# Altium schematic sheet stm32f103c8t6.SchDoc
size A4
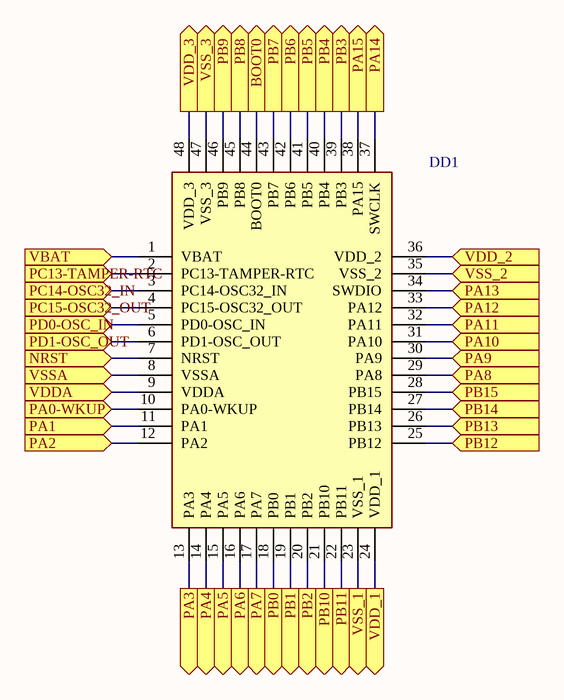
[diagram p0: stm32f103c8t6.SchDoc]

## Parts
DD1  stm32f103c8t6  [QFP50P900X900X160-48N]  (value not drawn)

## Ports
BOOT0, NRST, PA0-WKUP, PA1, PA2, PA3, PA4, PA5, PA6, PA7, PA8, PA9, PA10, PA11, PA12, PA13, PA14, PA15, PB0, PB1, PB2, PB3, PB4, PB5, PB6, PB7, PB8, PB9, PB10, PB11, PB12, PB13, PB14, PB15, PC13-TAMPER-RTC, PC14-OSC32_IN, PC15-OSC32_OUT, PD0-OSC_IN, PD1-OSC_OUT, VBAT, VDD_1, VDD_2, VDD_3, VDDA, VSS_1, VSS_2, VSS_3, VSSA

## Nets
BOOT0: DD1.44(BOOT0) ; port BOOT0
NRST: DD1.7(NRST) ; port NRST
PA0-WKUP: DD1.10(PA0-WKUP) ; port PA0-WKUP
PA1: DD1.11(PA1) ; port PA1
PA2: DD1.12(PA2) ; port PA2
PA3: DD1.13(PA3) ; port PA3
PA4: DD1.14(PA4) ; port PA4
PA5: DD1.15(PA5) ; port PA5
PA6: DD1.16(PA6) ; port PA6
PA7: DD1.17(PA7) ; port PA7
PA8: DD1.29(PA8) ; port PA8
PA9: DD1.30(PA9) ; port PA9
PA10: DD1.31(PA10) ; port PA10
PA11: DD1.32(PA11) ; port PA11
PA12: DD1.33(PA12) ; port PA12
PA13: DD1.34(SWDIO) ; port PA13
PA14: DD1.37(SWCLK) ; port PA14
PA15: DD1.38(PA15) ; port PA15
PB0: DD1.18(PB0) ; port PB0
PB1: DD1.19(PB1) ; port PB1
PB2: DD1.20(PB2) ; port PB2
PB3: DD1.39(PB3) ; port PB3
PB4: DD1.40(PB4) ; port PB4
PB5: DD1.41(PB5) ; port PB5
PB6: DD1.42(PB6) ; port PB6
PB7: DD1.43(PB7) ; port PB7
PB8: DD1.45(PB8) ; port PB8
PB9: DD1.46(PB9) ; port PB9
PB10: DD1.21(PB10) ; port PB10
PB11: DD1.22(PB11) ; port PB11
PB12: DD1.25(PB12) ; port PB12
PB13: DD1.26(PB13) ; port PB13
PB14: DD1.27(PB14) ; port PB14
PB15: DD1.28(PB15) ; port PB15
PC13-TAMPER-RTC: DD1.2(PC13-TAMPER-RTC) ; port PC13-TAMPER-RTC
PC14-OSC32_IN: DD1.3(PC14-OSC32_IN) ; port PC14-OSC32_IN
PC15-OSC32_OUT: DD1.4(PC15-OSC32_OUT) ; port PC15-OSC32_OUT
PD0-OSC_IN: DD1.5(PD0-OSC_IN) ; port PD0-OSC_IN
PD1-OSC_OUT: DD1.6(PD1-OSC_OUT) ; port PD1-OSC_OUT
VBAT: DD1.1(VBAT) ; port VBAT
VDD_1: DD1.24(VDD_1) ; port VDD_1
VDD_2: DD1.36(VDD_2) ; port VDD_2
VDD_3: DD1.48(VDD_3) ; port VDD_3
VDDA: DD1.9(VDDA) ; port VDDA
VSS_1: DD1.23(VSS_1) ; port VSS_1
VSS_2: DD1.35(VSS_2) ; port VSS_2
VSS_3: DD1.47(VSS_3) ; port VSS_3
VSSA: DD1.8(VSSA) ; port VSSA

## Library data of the parts
DD1 = stm32f103c8t6: Integrated Circuit; Manufacturer_Name: STMicroelectronics; Datasheet Link: https://www.st.com/resource/en/datasheet/stm32f103c8.pdf; Height: 1.6mm; Manufacturer_Part_Number: stm32f103c8t6; Mouser Part Number: 511-STM32F103C8T6; Mouser Price/Stock: https://www.mouser.co.uk/ProductDetail/STMicroelectronics/STM32F103C8T6/?qs=bhCVus9SdFtq6kqxsU5%2FDA%3D%3D; Arrow Part Number: STM32F103C8T6; Arrow Price/Stock: https://www.arrow.com/en/products/stm32f103c8t6/stmicroelectronics